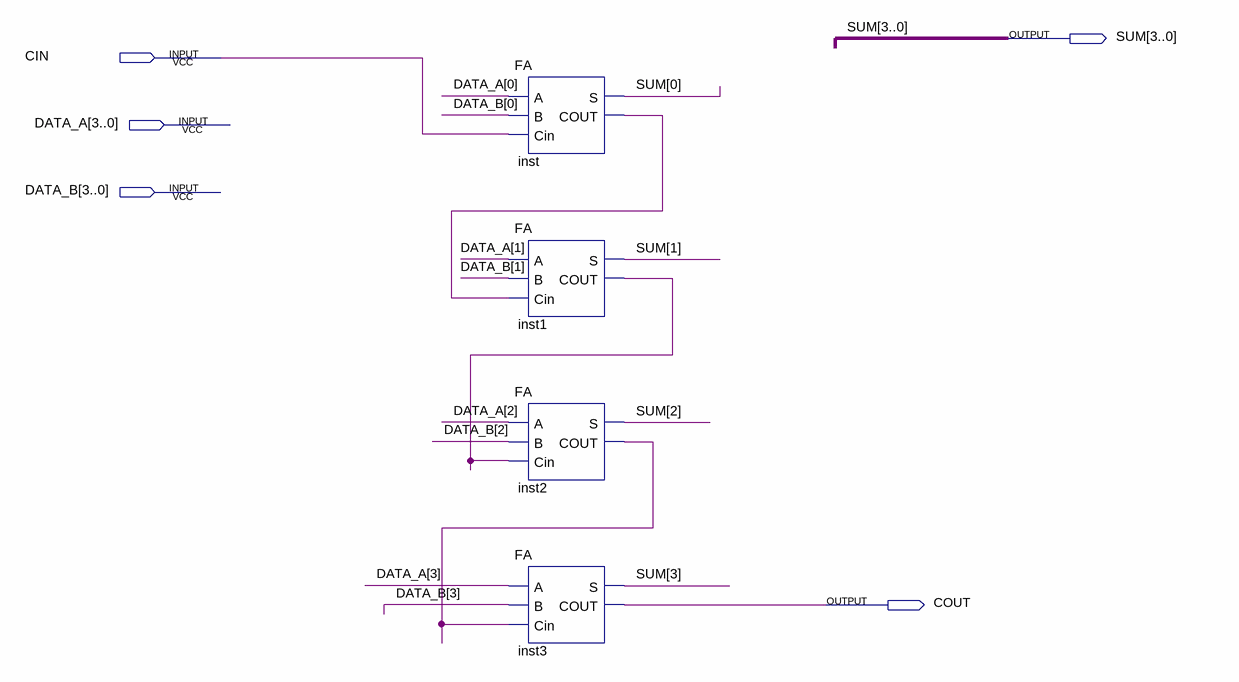
[diagram p0: schematic sheet]
// Quartus schematic RCadder_4bit.bdf as structural Verilog: 4 symbols, 5 pins
module RCadder_4bit (
  input  CIN,
  input  [3:0] DATA_A,
  input  [3:0] DATA_B,
  output [3:0] SUM,
  output COUT
);

  wire inst1_cout, inst2_cout, inst_cout;

  FA inst (.A(DATA_A[0]), .B(DATA_B[0]), .Cin(CIN), .S(SUM[0]), .COUT(inst_cout));
  FA inst1 (.A(DATA_A[1]), .B(DATA_B[1]), .Cin(inst_cout), .S(SUM[1]), .COUT(inst1_cout));
  FA inst2 (.A(DATA_A[2]), .B(DATA_B[2]), .Cin(inst1_cout), .S(SUM[2]), .COUT(inst2_cout));
  FA inst3 (.A(DATA_A[3]), .B(DATA_B[3]), .Cin(inst2_cout), .S(SUM[3]), .COUT(COUT));
endmodule
